# Altium project BCM.PrjPcb
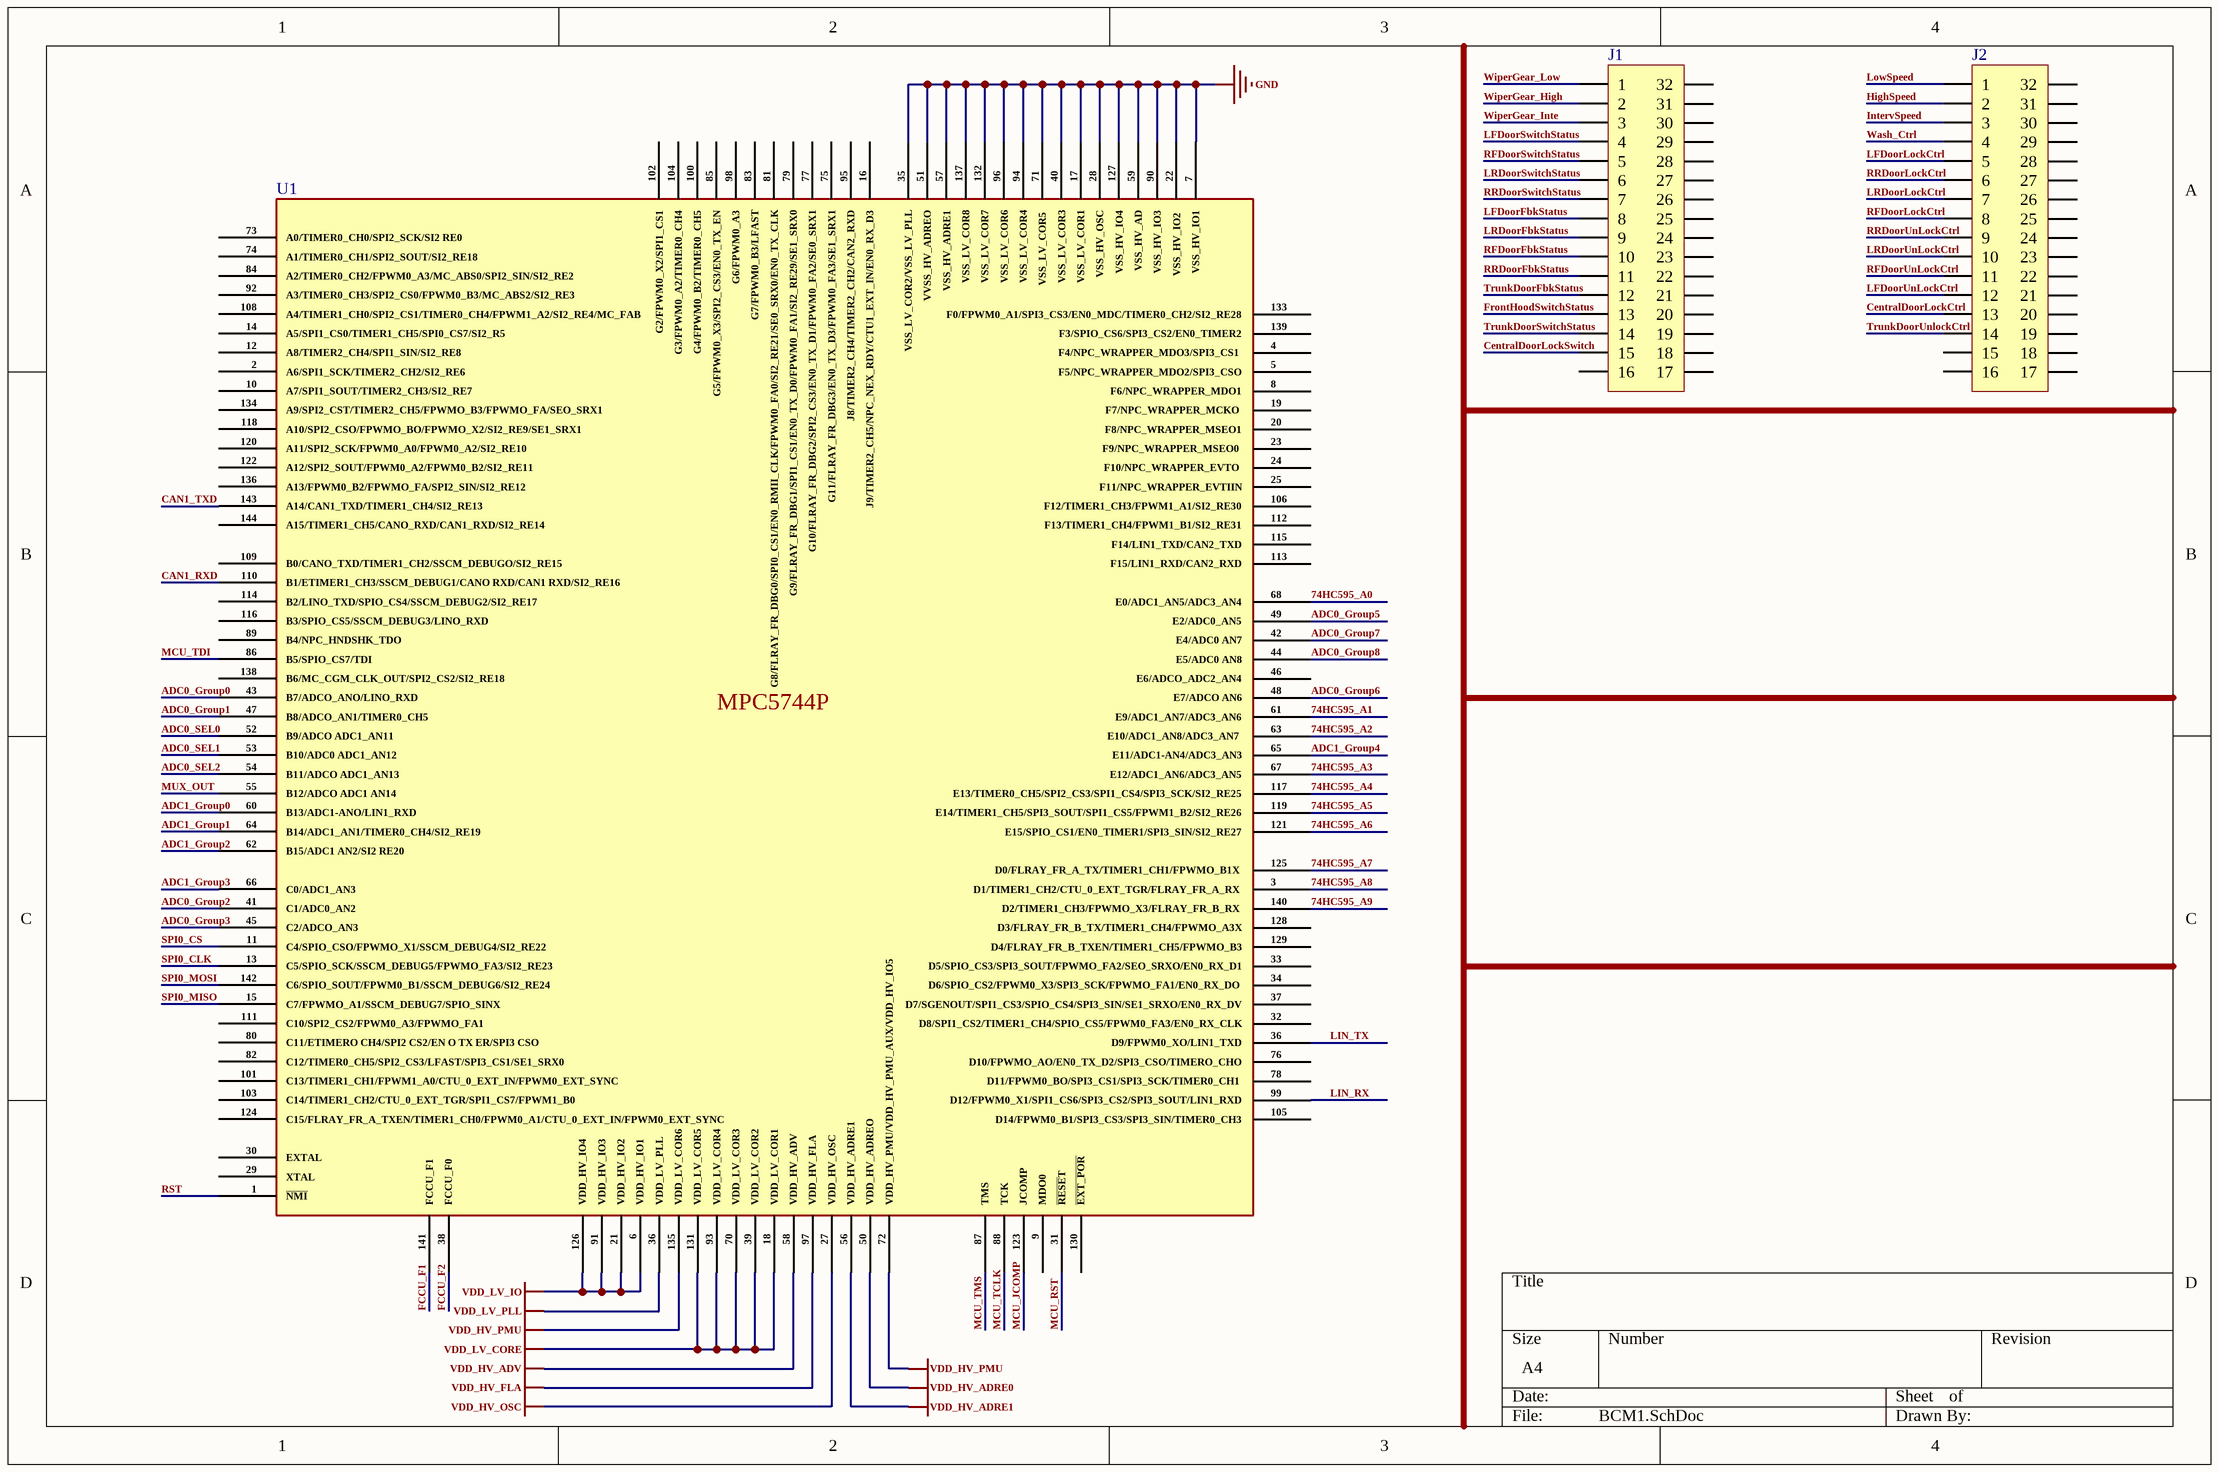
[diagram p0: BCM1.SchDoc]
4 sheets, 143 parts. Net scope: global (net labels, ports and power ports of the same name join across sheets).
Sheets:
  BCM1.SchDoc
  BCM2.SchDoc
  BCM3.SchDoc
  BCM4.SchDoc

## Sheet BCM1.SchDoc
size A4; SheetNumber: 1; SheetTotal: 5

### Parts
J1  DIP32  (value not drawn)
J2  DIP32  (value not drawn)
U1  MPC5744PFK1AMLQ9  (value not drawn)

### Nets
GND: U1.7(VSS_HV_IO1) U1.17(VSS_LV_COR1) U1.22(VSS_HV_IO2) U1.28(VSS_HV_OSC) U1.35(VSS_LV_COR2/VSS_LV_PLL) U1.40(VSS_LV_COR3) U1.51(VVSS_HV_ADREO) U1.57(VSS_HV_ADRE1) U1.59(VSS_HV_AD) U1.71(VSS_LV_COR5) U1.90(VSS_HV_IO3) U1.94(VSS_LV_COR4) U1.96(VSS_LV_COR6) U1.127(VSS_HV_IO4) U1.132(VSS_LV_COR7) U1.137(VSS_LV_COR8)  [project net DEBUG]
MCU_TDI: U1.86(B5/SPIO_CS7/TDI)
VDD_HV_ADRE0: U1.50(VDD_HV_ADREO)
VDD_HV_ADRE1: U1.56(VDD_HV_ADRE1)
VDD_HV_ADV: U1.58(VDD_HV_ADV)
VDD_HV_FLA: U1.97(VDD_HV_FLA)
VDD_HV_OSC: U1.27(VDD_HV_OSC)
VDD_HV_PMU: U1.72(VDD_HV_PMU/VDD_HV_PMU_AUX/VDD_HV_IO5) U1.135(VDD_LV_COR6)
VDD_LV_CORE: U1.18(VDD_LV_COR1) U1.39(VDD_LV_COR2) U1.70(VDD_LV_COR3) U1.93(VDD_LV_COR4) U1.131(VDD_LV_COR5)
VDD_LV_IO: U1.6(VDD_HV_IO1) U1.21(VDD_HV_IO2) U1.91(VDD_HV_IO3) U1.126(VDD_HV_IO4)
VDD_LV_PLL: U1.36(VDD_LV_PLL)
74HC595_A0: U1.68(E0/ADC1_AN5/ADC3_AN4)
74HC595_A1: U1.61(E9/ADC1_AN7/ADC3_AN6)
74HC595_A2: U1.63(E10/ADC1_AN8/ADC3_AN7)
74HC595_A3: U1.67(E12/ADC1_AN6/ADC3_AN5)
74HC595_A4: U1.117(E13/TIMER0_CH5/SPI2_CS3/SPI1_CS4/SPI3_SCK/SI2_RE25)
74HC595_A5: U1.119(E14/TIMER1_CH5/SPI3_SOUT/SPI1_CS5/FPWM1_B2/SI2_RE26)
74HC595_A6: U1.121(E15/SPIO_CS1/EN0_TIMER1/SPI3_SIN/SI2_RE27)
74HC595_A7: U1.125(D0/FLRAY_FR_A_TX/TIMER1_CH1/FPWMO_B1X)
74HC595_A8: U1.3(D1/TIMER1_CH2/CTU_0_EXT_TGR/FLRAY_FR_A_RX)
74HC595_A9: U1.140(D2/TIMER1_CH3/FPWMO_X3/FLRAY_FR_B_RX)
ADC0_Group0: U1.43(B7/ADCO_ANO/LINO_RXD)
ADC0_Group1: U1.47(B8/ADCO_AN1/TIMER0_CH5)
ADC0_Group2: U1.41(C1/ADC0_AN2)
ADC0_Group3: U1.45(C2/ADCO_AN3)
ADC0_Group5: U1.49(E2/ADC0_AN5)
ADC0_Group6: U1.48(E7/ADCO_AN6)
ADC0_Group7: U1.42(E4/ADC0_AN7)
ADC0_Group8: U1.44(E5/ADC0_AN8)
ADC0_SEL0: U1.52(B9/ADCO_ADC1_AN11)
ADC0_SEL1: U1.53(B10/ADC0_ADC1_AN12)
ADC0_SEL2: U1.54(B11/ADCO_ADC1_AN13)
ADC1_Group0: U1.60(B13/ADC1-ANO/LIN1_RXD)
ADC1_Group1: U1.64(B14/ADC1_AN1/TIMER0_CH4/SI2_RE19)
ADC1_Group2: U1.62(B15/ADC1_AN2/SI2_RE20)
ADC1_Group3: U1.66(C0/ADC1_AN3)
ADC1_Group4: U1.65(E11/ADC1-AN4/ADC3_AN3)
CAN1_RXD: U1.110(B1/ETIMER1_CH3/SSCM_DEBUG1/CANO_RXD/CAN1_RXD/SI2_RE16)
CAN1_TXD: U1.143(A14/CAN1_TXD/TIMER1_CH4/SI2_RE13)
CentralDoorLockCtrl: J2.13
CentralDoorLockSwitch: J1.15
FCCU_F1: U1.141(FCCU_F1)
FCCU_F2: U1.38(FCCU_F0)
FrontHoodSwitchStatus: J1.13
HighSpeed: J2.2
IntervSpeed: J2.3
LFDoorFbkStatus: J1.8
LFDoorLockCtrl: J2.5
LFDoorSwitchStatus: J1.4
LFDoorUnLockCtrl: J2.12
LIN_RX: U1.99(D12/FPWM0_X1/SPI1_CS6/SPI3_CS2/SPI3_SOUT/LIN1_RXD)
LIN_TX: U1.36(D9/FPWM0_XO/LIN1_TXD)
LowSpeed: J2.1
LRDoorFbkStatus: J1.9
LRDoorLockCtrl: J2.7
LRDoorSwitchStatus: J1.6
LRDoorUnLockCtrl: J2.10
MCU_JCOMP: U1.123(JCOMP)
MCU_RST: U1.31(~{RESE}T)  [project net DEBUG_RST]
MCU_TCLK: U1.88(TCK)
MCU_TMS: U1.87(TMS)
MUX_OUT: U1.55(B12/ADCO_ADC1_AN14)
RFDoorFbkStatus: J1.10
RFDoorLockCtrl: J2.8
RFDoorSwitchStatus: J1.5
RFDoorUnLockCtrl: J2.11
RRDoorFbkStatus: J1.11
RRDoorLockCtrl: J2.6
RRDoorSwitchStatus: J1.7
RRDoorUnLockCtrl: J2.9
RST: U1.1(~{NMI})
SPI0_CLK: U1.13(C5/SPIO_SCK/SSCM_DEBUG5/FPWMO_FA3/SI2_RE23)
SPI0_CS: U1.11(C4/SPIO_CSO/FPWMO_X1/SSCM_DEBUG4/SI2_RE22)
SPI0_MISO: U1.15(C7/FPWMO_A1/SSCM_DEBUG7/SPIO_SINX)
SPI0_MOSI: U1.142(C6/SPIO_SOUT/FPWM0_B1/SSCM_DEBUG6/SI2_RE24)
TrunkDoorFbkStatus: J1.12
TrunkDoorSwitchStatus: J1.14
TrunkDoorUnlockCtrl: J2.14
Wash_Ctrl: J2.4
WiperGear_High: J1.2
WiperGear_Inte: J1.3
WiperGear_Low: J1.1

Not connected (* = marked no-connect by the designer): J1 16 17 18 19 20 21 22 23 24 25 26 27 28 29 30 31 32; J2 15 16 17 18 19 20 21 22 23 24 25 26 27 28 29 30 31 32; U1 2(A6/SPI1_SCK/TIMER2_CH2/SI2_RE6) 4(F4/NPC_WRAPPER_MDO3/SPI3_CS1_) 5(F5/NPC_WRAPPER_MDO2/SPI3_CSO) 8(F6/NPC_WRAPPER_MDO1) 9(MDO0) 10(A7/SPI1_SOUT/TIMER2_CH3/SI2_RE7) 12(A8/TIMER2_CH4/SPI1_SIN/SI2_RE8) 14(A5/SPI1_CS0/TIMER1_CH5/SPI0_CS7/SI2_R5) 16(J9/TIMER2_CH5/NPC_NEX_RDY/CTU1_EXT_IN/EN0_RX_D3) 19(F7/NPC_WRAPPER_MCKO_) 20(F8/NPC_WRAPPER_MSEO1) 23(F9/NPC_WRAPPER_MSEO0_) 24(F10/NPC_WRAPPER_EVTO_) 25(F11/NPC_WRAPPER_EVTIIN) 29(XTAL) 30(EXTAL) 32(D8/SPI1_CS2/TIMER1_CH4/SPIO_CS5/FPWM0_FA3/EN0_RX_CLK) 33(D5/SPIO_CS3/SPI3_SOUT/FPWMO_FA2/SEO_SRXO/EN0_RX_D1) 34(D6/SPIO_CS2/FPWM0_X3/SPI3_SCK/FPWMO_FA1/EN0_RX_DO_) 37(D7/SGENOUT/SPI1_CS3/SPIO_CS4/SPI3_SIN/SE1_SRXO/EN0_RX_DV) 46(E6/ADCO_ADC2_AN4) 73(A0/TIMER0_CH0/SPI2_SCK/SI2_RE0) 74(A1/TIMER0_CH1/SPI2_SOUT/SI2_RE18) 75(G11/FLRAY_FR_DBG3/EN0_TX_D3/FPWM0_FA3/SE1_SRX1) 76(D10/FPWMO_AO/EN0_TX_D2/SPI3_CSO/TIMERO_CHO) 77(G10/FLRAY_FR_DBG2/SPI2_CS3/EN0_TX_D1/FPWM0_FA2/SE0_SRX1) 78(D11/FPWM0_BO/SPI3_CS1/SPI3_SCK/TIMER0_CH1_) 79(G9/FLRAY_FR_DBG1/SPI1_CS1/EN0_TX_D0/FPWM0_FA1/SI2_RE29/SE1_SRX0) 80(C11/ETIMERO_CH4/SPI2_CS2/EN_O_TX_ER/SPI3_CSO) 81(G8/FLRAY_FR_DBG0/SPI0_CS1/EN0_RMII_CLK/FPWM0_FA0/SI2_RE21/SE0_SRX0/EN0_TX_CLK) 82(C12/TIMER0_CH5/SPI2_CS3/LFAST/SPI3_CS1/SE1_SRX0) 83(G7/FPWM0_B3/LFAST) 84(A2/TIMER0_CH2/FPWM0_A3/MC_ABS0/SPI2_SIN/SI2_RE2) 85(G5/FPWM0_X3/SPI2_CS3/EN0_TX_EN) 89(B4/NPC_HNDSHK_TDO) 92(A3/TIMER0_CH3/SPI2_CS0/FPWM0_B3/MC_ABS2/SI2_RE3) 95(J8/TIMER2_CH4/TIMER2_CH2/CAN2_RXD) 98(G6/FPWM0_A3) 100(G4/FPWM0_B2/TIMER0_CH5) 101(C13/TIMER1_CH1/FPWM1_A0/CTU_0_EXT_IN/FPWM0_EXT_SYNC) 102(G2/FPWM0_X2/SPI1_CS1) 103(C14/TIMER1_CH2/CTU_0_EXT_TGR/SPI1_CS7/FPWM1_B0) 104(G3/FPWM0_A2/TIMER0_CH4) 105(D14/FPWM0_B1/SPI3_CS3/SPI3_SIN/TIMER0_CH3) 106(F12/TIMER1_CH3/FPWM1_A1/SI2_RE30) 108(A4/TIMER1_CH0/SPI2_CS1/TIMER0_CH4/FPWM1_A2/SI2_RE4/MC_FAB_) 109(B0/CANO_TXD/TIMER1_CH2/SSCM_DEBUGO/SI2_RE15) 111(C10/SPI2_CS2/FPWM0_A3/FPWMO_FA1) 112(F13/TIMER1_CH4/FPWM1_B1/SI2_RE31) 113(F15/LIN1_RXD/CAN2_RXD) 114(B2/LINO_TXD/SPIO_CS4/SSCM_DEBUG2/SI2_RE17) 115(F14/LIN1_TXD/CAN2_TXD) 116(B3/SPIO_CS5/SSCM_DEBUG3/LINO_RXD) 118(A10/SPI2_CSO/FPWMO_BO/FPWMO_X2/SI2_RE9/SE1_SRX1) 120(A11/SPI2_SCK/FPWM0_A0/FPWM0_A2/SI2_RE10) 122(A12/SPI2_SOUT/FPWM0_A2/FPWM0_B2/SI2_RE11) 124(C15/FLRAY_FR_A_TXEN/TIMER1_CH0/FPWM0_A1/CTU_0_EXT_IN/FPWM0_EXT_SYNC) 128(D3/FLRAY_FR_B_TX/TIMER1_CH4/FPWMO_A3X) 129(D4/FLRAY_FR_B_TXEN/TIMER1_CH5/FPWMO_B3) 130(~{EXT_POR}) 133(F0/FPWM0_A1/SPI3_CS3/EN0_MDC/TIMER0_CH2/SI2_RE28) 134(A9/SPI2_CST/TIMER2_CH5/FPWMO_B3/FPWMO_FA/SEO_SRX1_) 136(A13/FPWM0_B2/FPWMO_FA/SPI2_SIN/SI2_RE12) 138(B6/MC_CGM_CLK_OUT/SPI2_CS2/SI2_RE18) 139(F3/SPIO_CS6/SPI3_CS2/EN0_TIMER2) 144(A15/TIMER1_CH5/CANO_RXD/CAN1_RXD/SI2_RE14)

### Notes on the sheet
- (in symbol MPC5744PFK1AMLQ9) MPC5744P

## Sheet BCM2.SchDoc
size A4; SheetNumber: 2; SheetTotal: 4
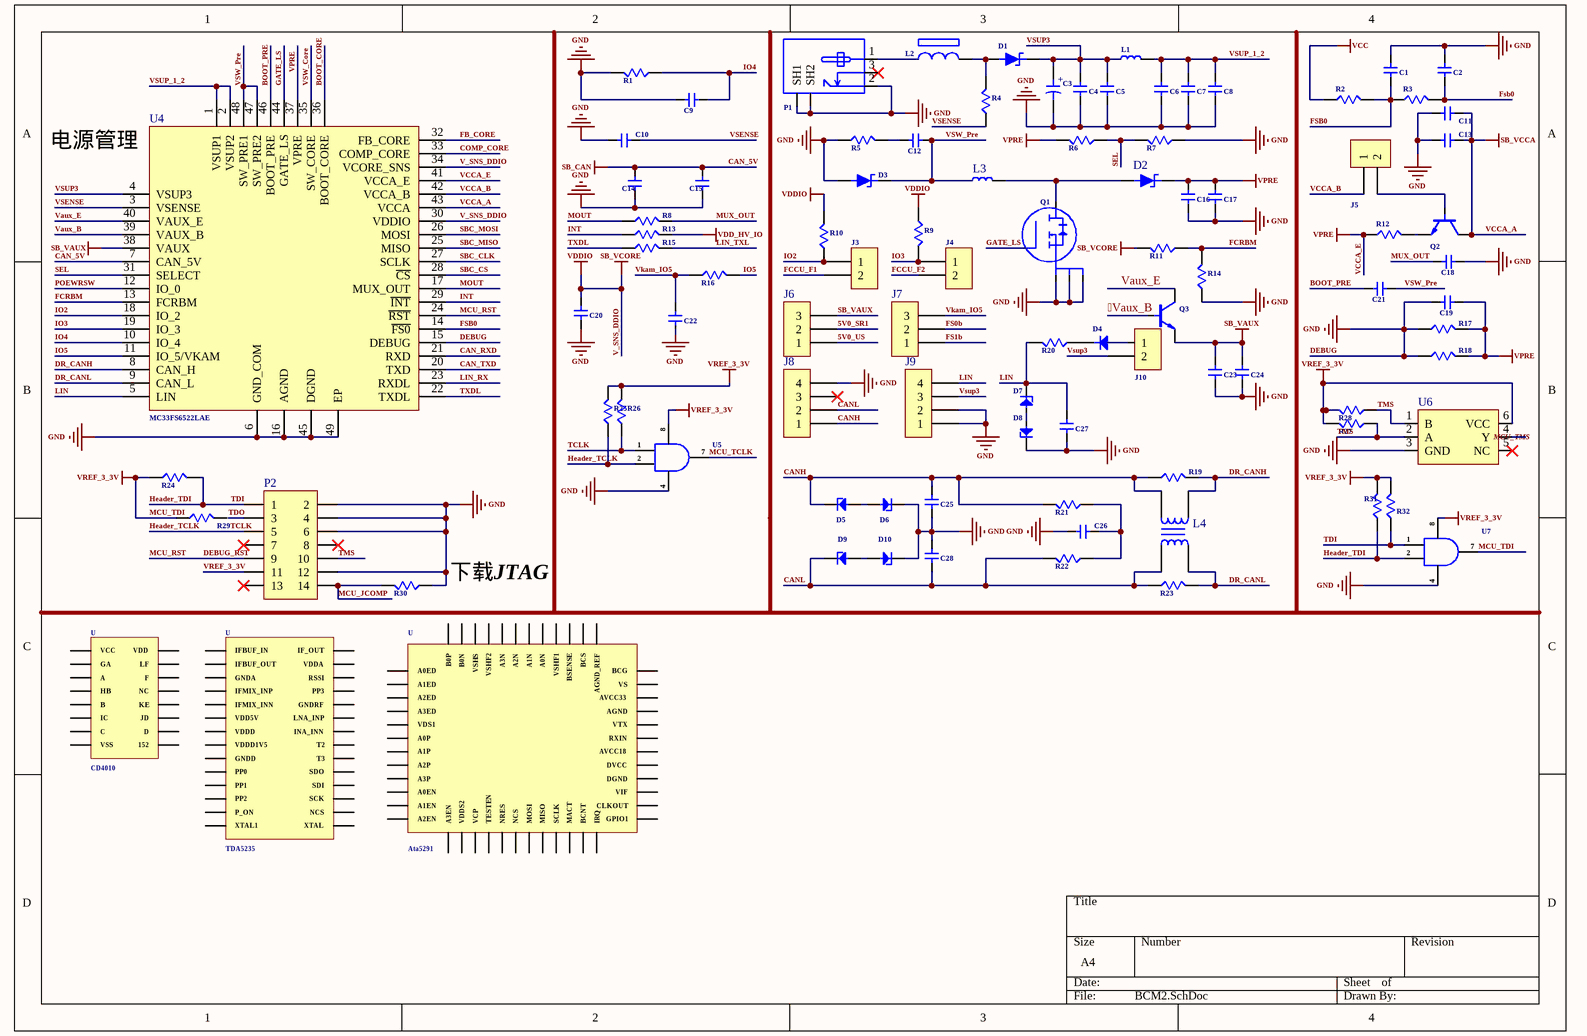
[diagram p1: BCM2.SchDoc]

### Parts
C1  CAP  (value not drawn)
C2  CAP  (value not drawn)
C3  CAP_Election  (value not drawn)
C4  CAP  (value not drawn)
C5  CAP  (value not drawn)
C6  CAP  (value not drawn)
C7  CAP  (value not drawn)
C8  CAP  (value not drawn)
C9  CAP  (value not drawn)
C10  CAP  (value not drawn)
C11  CAP  (value not drawn)
C12  CAP  (value not drawn)
C13  CAP  (value not drawn)
C14  CAP  (value not drawn)
C15  CAP  (value not drawn)
C16  CAP  (value not drawn)
C17  CAP  (value not drawn)
C18  CAP  (value not drawn)
C19  CAP  (value not drawn)
C20  CAP  (value not drawn)
C21  CAP  (value not drawn)
C22  CAP  (value not drawn)
C23  CAP  (value not drawn)
C24  CAP  (value not drawn)
C25  CAP  (value not drawn)
C26  CAP  (value not drawn)
C27  CAP  (value not drawn)
C28  CAP  (value not drawn)
D1  ZENER  (value not drawn)
D2  ZENER  (value not drawn)
D3  ZENER  (value not drawn)
D4  DIODE  (value not drawn)
D5  ZENER1  (value not drawn)
D6  ZENER1  (value not drawn)
D7  ZENER1  (value not drawn)
D8  ZENER1  (value not drawn)
D9  ZENER1  (value not drawn)
D10  ZENER1  (value not drawn)
J3  CON2  (value not drawn)
J4  CON2  (value not drawn)
J5  CON2  [DG1282-5.0]  (value not drawn)
J6  CON3  (value not drawn)
J7  CON3  (value not drawn)
J8  CON4  (value not drawn)
J9  CON4  (value not drawn)
J10  CON2  (value not drawn)
L1  L  (value not drawn)
L2  BLM18KG121TZ1  (value not drawn)
L3  L  (value not drawn)
L4  TRANS1  (value not drawn)
P1  CON_PWR  (value not drawn)
P2  DIP14  (value not drawn)
Q1  BUK9M24  (value not drawn)
Q2  NPN  [TO-92]  (value not drawn)
Q3  NPN  [TO-92]  (value not drawn)
R1  RES  (value not drawn)
R2  RES  (value not drawn)
R3  RES  (value not drawn)
R4  RES  (value not drawn)
R5  RES  (value not drawn)
R6  RES  (value not drawn)
R7  RES  (value not drawn)
R8  RES  (value not drawn)
R9  RES  (value not drawn)
R10  RES  (value not drawn)
R11  RES  (value not drawn)
R12  RES  (value not drawn)
R13  RES  (value not drawn)
R14  RES  (value not drawn)
R15  RES  (value not drawn)
R16  RES  (value not drawn)
R17  RES  (value not drawn)
R18  RES  (value not drawn)
R19  RES  (value not drawn)
R20  RES  (value not drawn)
R21  RES  (value not drawn)
R22  RES  (value not drawn)
R23  RES  (value not drawn)
R24  RES  (value not drawn)
R25  RES  (value not drawn)
R26  RES  (value not drawn)
R27  RES  (value not drawn)
R28  RES  (value not drawn)
R29  RES  (value not drawn)
R30  RES  (value not drawn)
R31  RES  (value not drawn)
R32  RES  (value not drawn)
U4  MC33FS6522LAE
U5  74LVC2G08  (value not drawn)
U6  74LVC1G08  (value not drawn)
U7  74LVC2G08  (value not drawn)

### Nets
CAN_5V: C14.1 C15.1 U4.7(CAN_5V)  [also labelled SB_CAN]
DEBUG: C1.1 C2.1 C3.2 C4.2 C5.2 C6.2 C7.2 C8.2 C9.1 C10.1 C11.2 C13.2 C14.2 C15.2 C16.2 C17.2 C18.1 C19.1 C20.2 C22.2 C23.2 C24.2 C25.1 C26.1 C27.1 C28.2 D3.1(A) D6.2(K) D8.2(K) D10.2(K) J8.4 J9.1 J9.2 P1.2 P1.5(SH1) P1.?1(SH2) P2.2 P2.4 P2.6 P2.12 Q1.1 Q1.2 Q1.3 R1.2 R5.1 R7.1 R14.1 R17.1 R18.1 R30.1 U4.6(GND_COM) U4.15(DEBUG) U4.16(AGND) U4.45(DGND) U4.49(EP) U5.4 U6.3(GND) U7.4  [also labelled GND]
MCU_TDI: P2.11 R24.1 R25.2 R26.2 R27.2 R28.2 R29.1 R31.2 R32.2 U5.8 U6.6(VCC) U7.7(Y) U7.8  [also labelled VREF_3_3V]
SB_VAUX: C23.1 C24.1 J6.3 Q3.E(e) U4.38(VAUX)
V_SNS_DDIO: C20.1 R9.1 R10.2 R11.2 U4.30(VDDIO) U4.34(VCORE_SNS)  [also labelled SB_VCORE, VDDIO]
VCC: R2.1
VCCA_A: C11.1 C13.1 Q2.C(c) U4.43(VCCA)  [also labelled SB_VCCA]
VCCA_E: C16.1 C17.1 C19.2 D2.2(K) R6.2 R12.1 R17.2 R18.2 U4.37(VPRE) U4.41(VCCA_E)  [also labelled VPRE]
VDD_HV_IO: R13.2
5V0_SR1: J6.2
5V0_US: J6.1
Vaux_B: Q3.B(b)
BOOT_CORE: U4.36(BOOT_CORE)
BOOT_PRE: C21.1 U4.46(BOOT_PRE)
CAN_RXD: U4.21(RXD)
CAN_TXD: U4.20(TXD)
CANH: C25.2 D5.2(K) J8.1 L4.3 R19.1 R21.2
CANL: C28.1 D9.2(K) J8.2 L4.1 R22.2 R23.1
COMP_CORE: U4.33(COMP_CORE)
DEBUG_RST: P2.9 U4.24(~{RST})  [also labelled MCU_RST]
DR_CANH: L4.1 R19.2 U4.8(CAN_H)
DR_CANL: L4.3 R23.2 U4.9(CAN_L)
FB_CORE: U4.32(FB_CORE)
FCCU_F1: J3.2
FCCU_F2: J4.2
FCRBM: R11.1 R14.2 U4.13(FCRBM)
FS0b: J7.2
FS1b: J7.1
Fsb0: C1.2 C2.2 R2.2 R3.1 R3.2 U4.14(~{FS0})
GATE_LS: Q1.5 U4.44(GATE_LS)
Header_TCLK: P2.5 R25.1 R26.1 U5.1(A) U5.2(B)  [also labelled TCLK]
Header_TDI: P2.1 R24.2 R31.1 R32.1 U7.1(A) U7.2(B)  [also labelled TDI]
INT: R13.1 U4.29(~{INT})
IO2: J3.1 R10.1 U4.18(IO_2)
IO3: J4.1 R9.2 U4.19(IO_3)
IO4: C9.2 R1.1 U4.10(IO_4)
IO5: R16.2 U4.11(IO_5/VKAM)
LIN: C27.2 D7.2(K) J9.4 R20.2 U4.5(LIN)
LIN_RX: U4.23(RXDL)
LIN_TXL: R15.2
MCU_JCOMP: P2.14 R30.2
MCU_TCLK: U5.7(Y)
MCU_TMS: U6.4(Y)
MOUT: R8.1 U4.17(MUX_OUT)
MUX_OUT: C18.2 R8.2
POEWRSW: U4.12(IO_0)
SBC_CLK: U4.27(SCLK)
SBC_CS: U4.28(~{CS})
SBC_MISO: U4.25(MISO)
SBC_MOSI: U4.26(MOSI)
SEL: R6.1 R7.2 U4.31(SELECT)
TDO: P2.3
TMS: P2.10 R27.1 R28.1 U6.1(B) U6.2(A)
TXDL: R15.1 U4.22(TXDL)
Vaux_B: U4.39(VAUX_B)
Vaux_E: Q3.C(c) U4.40(VAUX_E)
VCCA_B: J5.1 U4.42(VCCA_B)
Vkam_IO5: C22.1 J7.3 R16.1
VSENSE: C10.2 R4.1 U4.3(VSENSE)
VSUP3: C3.1 C4.1 C5.1 D1.2(K) J9.3 J10.2 L1.2 U4.4(VSUP3)
VSUP_1_2: C6.1 C7.1 C8.1 L1.1 U4.1(VSUP1) U4.2(VSUP2)
VSW_Core: U4.35(SW_CORE)
VSW_Pre: C12.1 C21.2 D3.2(K) L3.2 U4.47(SW_PRE2) U4.48(SW_PRE1)
NetC12_2: C12.2 R5.2
NetC26_2: C26.2 R21.1 R22.1
NetD1_1: D1.1(A) L2.1 R4.2
NetD2_1: D2.1(A) L3.1 Q1.5
NetD4_1: D4.1(A) J10.1
NetD4_2: D4.2(K) R20.1
NetD5_1: D5.1(A) D6.1(A)
NetD7_1: D7.1(A) D8.1(A)
NetD9_1: D9.1(A) D10.1(A)
NetJ5_2: J5.2 Q2.B(b)
NetL2_2: L2.2 P1.1
NetQ2_E: Q2.E(e) R12.2

Not connected (* = marked no-connect by the designer): J8 3*; P1 3*; P2 7* 8* 13*; R29 2; U6 5(NC)*

### Notes on the sheet
- (near U4) 电源管理
- (near R30) 下载JTAG
- (in symbol CAP_Election) +

### Library data of the parts
J3 J4 J10 = CON2: Connector
J6 J7 = CON3: Connector
J8 J9 = CON4: Connector

## Sheet BCM3.SchDoc
size A4; SheetNumber: 3; SheetTotal: 5
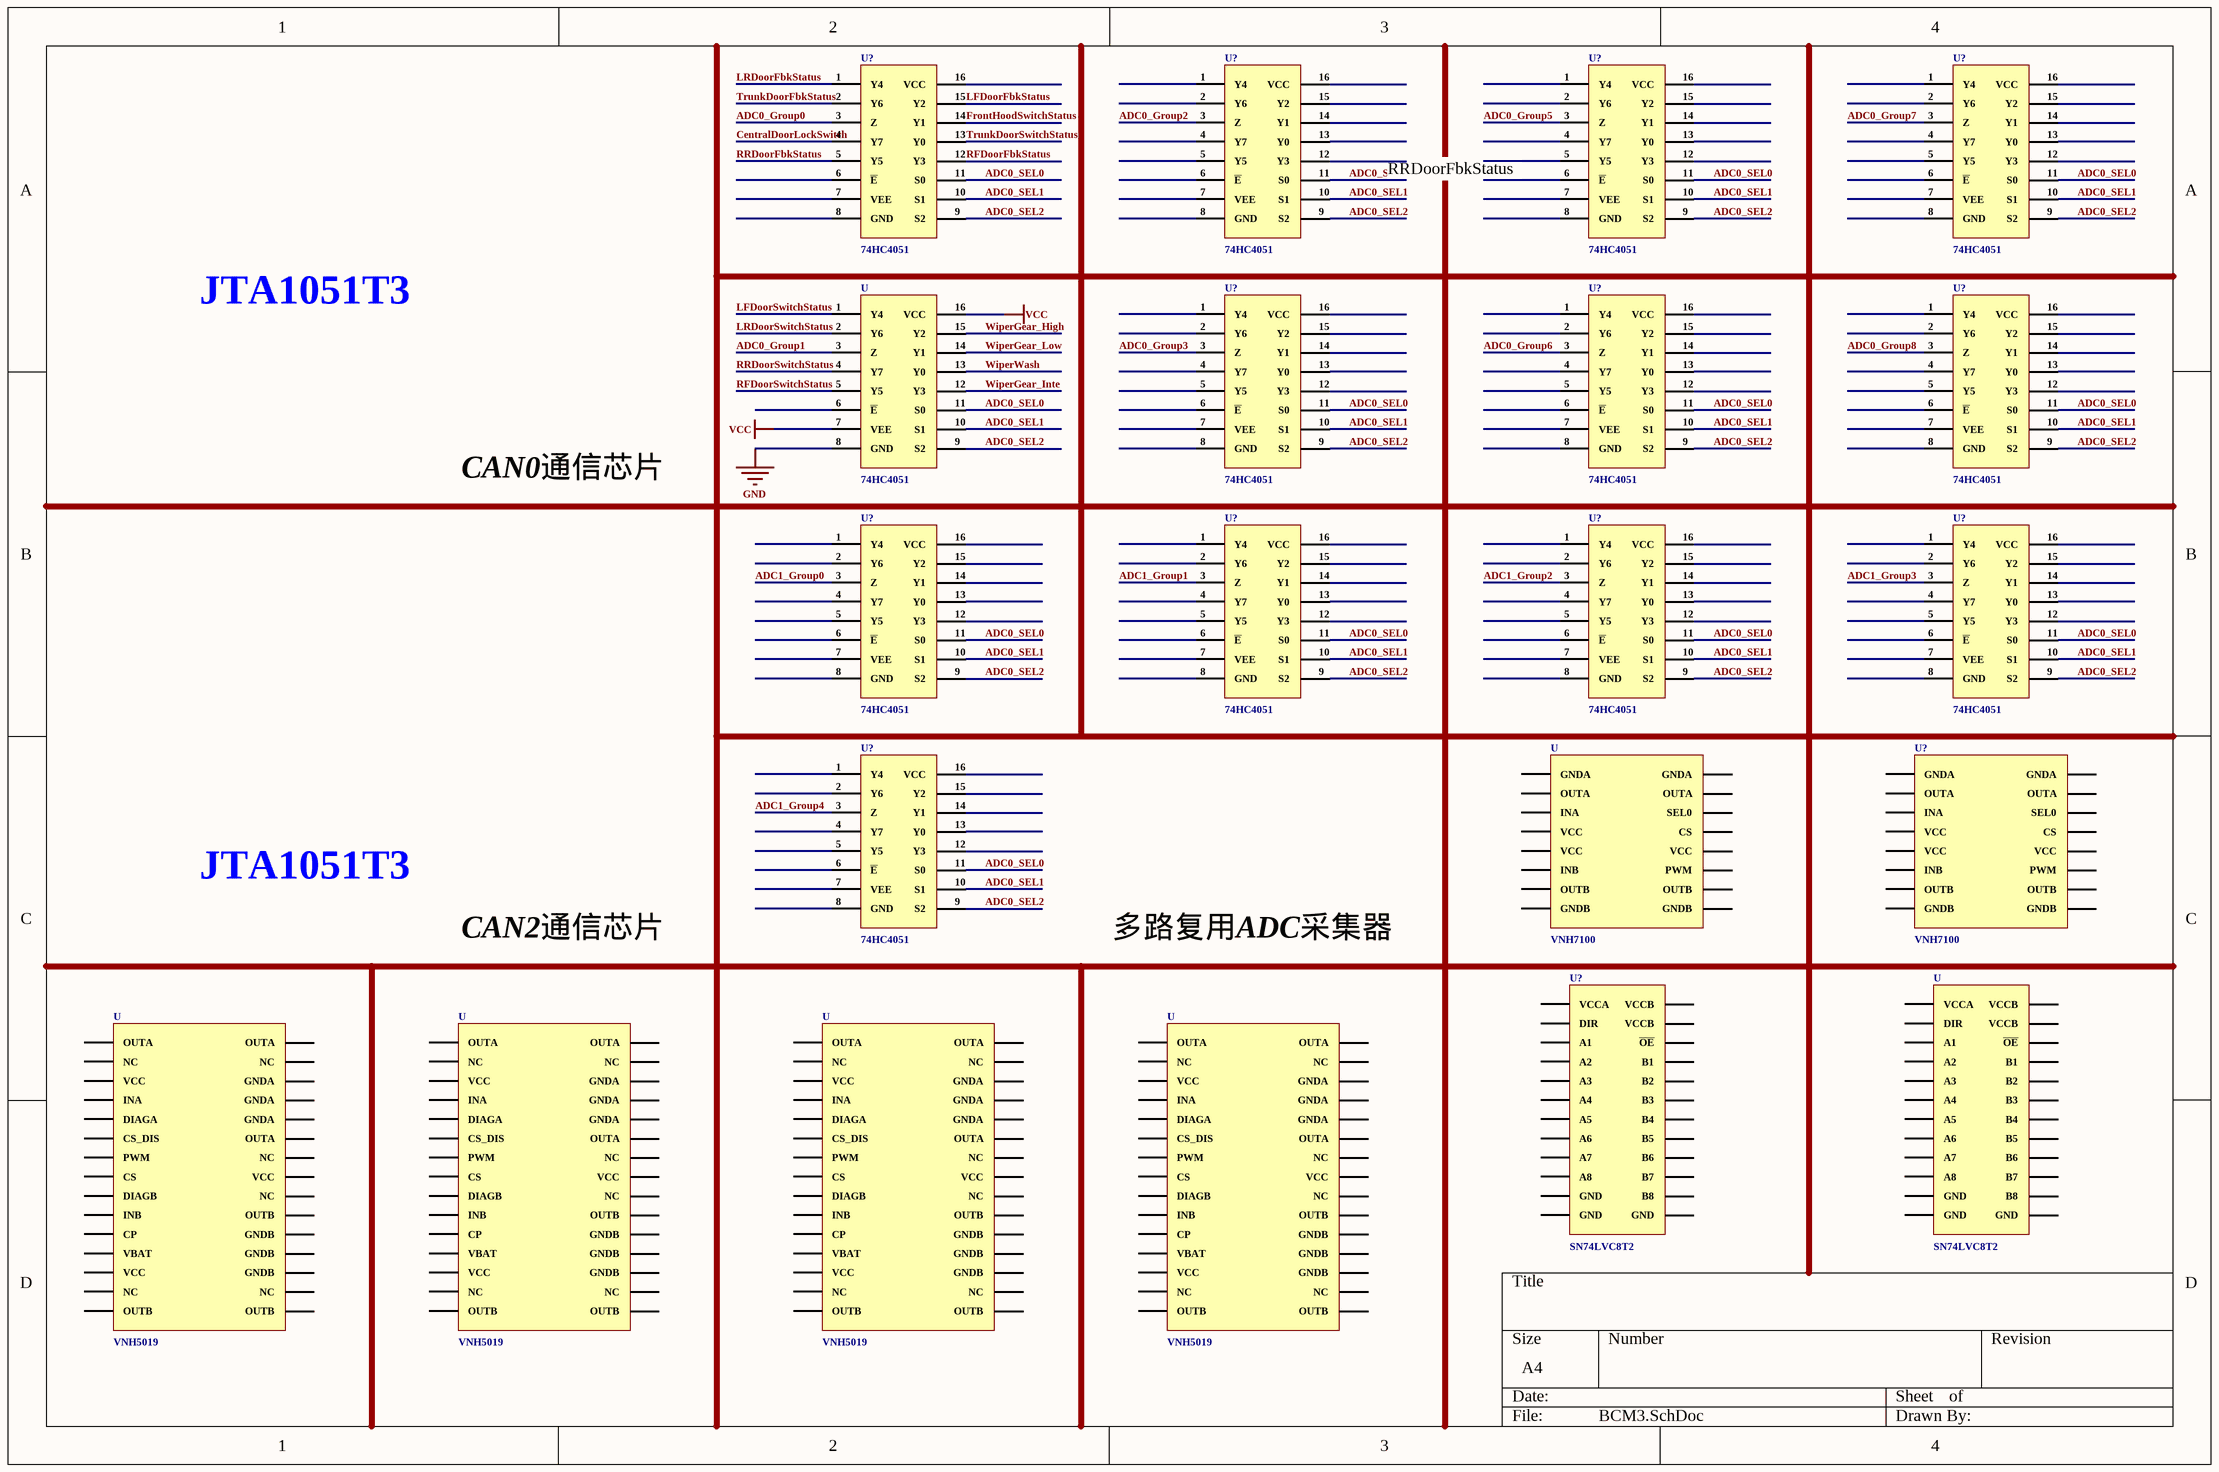
[diagram p2: BCM3.SchDoc]

### Parts
(Parts that share a designator on the sheet are numbered #1, #2 ... from top to bottom, then left to right.)
U#1  74HC4051
U#2  VNH7100
U#3  SN74LVC8T2
U#4  VNH5019
U#5  VNH5019
U#6  VNH5019
U#7  VNH5019
U?#1  74HC4051
U?#2  74HC4051
U?#3  74HC4051
U?#4  74HC4051
U?#5  74HC4051
U?#6  74HC4051
U?#7  74HC4051
U?#8  74HC4051
U?#9  74HC4051
U?#10  74HC4051
U?#11  74HC4051
U?#12  74HC4051
U?#13  VNH7100
U?#14  SN74LVC8T2

### Nets
GND: U#1.8(GND)  [project net DEBUG]
VCC: U#1.7(VEE) U#1.16(VCC)
ADC0_Group0: U?#1.3(Z)
ADC0_Group1: U#1.3(Z)
ADC0_Group2: U?#2.3(Z)
ADC0_Group3: U?#5.3(Z)
ADC0_Group5: U?#3.3(Z)
ADC0_Group6: U?#6.3(Z)
ADC0_Group7: U?#4.3(Z)
ADC0_Group8: U?#7.3(Z)
ADC0_SEL0: U#1.11(S0) U?#1.11(S0) U?#2.11(S0) U?#3.11(S0) U?#4.11(S0) U?#5.11(S0) U?#6.11(S0) U?#7.11(S0) U?#8.11(S0) U?#9.11(S0) U?#10.11(S0) U?#11.11(S0) U?#12.11(S0)
ADC0_SEL1: U#1.10(S1) U?#1.10(S1) U?#2.10(S1) U?#3.10(S1) U?#4.10(S1) U?#5.10(S1) U?#6.10(S1) U?#7.10(S1) U?#8.10(S1) U?#9.10(S1) U?#10.10(S1) U?#11.10(S1) U?#12.10(S1)
ADC0_SEL2: U#1.9(S2) U?#1.9(S2) U?#2.9(S2) U?#3.9(S2) U?#4.9(S2) U?#5.9(S2) U?#6.9(S2) U?#7.9(S2) U?#8.9(S2) U?#9.9(S2) U?#10.9(S2) U?#11.9(S2) U?#12.9(S2)
ADC1_Group0: U?#8.3(Z)
ADC1_Group1: U?#9.3(Z)
ADC1_Group2: U?#10.3(Z)
ADC1_Group3: U?#11.3(Z)
ADC1_Group4: U?#12.3(Z)
CentralDoorLockSwitch: U?#1.4(Y7)
FrontHoodSwitchStatus: U?#1.14(Y1)
LFDoorFbkStatus: U?#1.15(Y2)
LFDoorSwitchStatus: U#1.1(Y4)
LRDoorFbkStatus: U?#1.1(Y4)
LRDoorSwitchStatus: U#1.2(Y6)
RFDoorFbkStatus: U?#1.12(Y3)
RFDoorSwitchStatus: U#1.5(Y5)
RRDoorFbkStatus: U?#1.5(Y5)
RRDoorSwitchStatus: U#1.4(Y7)
TrunkDoorFbkStatus: U?#1.2(Y6)
TrunkDoorSwitchStatus: U?#1.13(Y0)
WiperGear_High: U#1.15(Y2)
WiperGear_Inte: U#1.12(Y3)
WiperGear_Low: U#1.14(Y1)
WiperWash: U#1.13(Y0)

Not connected (* = marked no-connect by the designer): U#1 6(~{E}); U#2 30(GNDA) 31(OUTA) 32(INA) 33(VCC) 34(VCC) 35(INB) 36(OUTB) 37(GNDB) 38(CS) 39(VCC) 40(PWM) 41(OUTB) 42(GNDB); U#3 2(DIR) ?1(A1) VCCA; U#4 43(OUTA) 44(NC) 45(VCC) 46(INA) 47(DIAGA) 48(CS_DIS) 49(PWM) 50(CS) 51(DIAGB) 52(INB) 53(CP) 54(VBAT) 55(VCC) 56(NC) 57(OUTB); U#5 43(OUTA) 44(NC) 45(VCC) 46(INA) 47(DIAGA) 48(CS_DIS) 49(PWM) 50(CS) 51(DIAGB) 52(INB) 53(CP) 54(VBAT) 55(VCC) 56(NC) 57(OUTB); U#6 43(OUTA) 44(NC) 45(VCC) 46(INA) 47(DIAGA) 48(CS_DIS) 49(PWM) 50(CS) 51(DIAGB) 52(INB) 53(CP) 54(VBAT) 55(VCC) 56(NC) 57(OUTB); U#7 43(OUTA) 44(NC) 45(VCC) 46(INA) 47(DIAGA) 48(CS_DIS) 49(PWM) 50(CS) 51(DIAGB) 52(INB) 53(CP) 54(VBAT) 55(VCC) 56(NC) 57(OUTB); U?#1 6(~{E}) 7(VEE) 8(GND) 16(VCC); U?#2 1(Y4) 2(Y6) 4(Y7) 5(Y5) 6(~{E}) 7(VEE) 8(GND) 12(Y3) 13(Y0) 14(Y1) 15(Y2) 16(VCC); U?#3 1(Y4) 2(Y6) 4(Y7) 5(Y5) 6(~{E}) 7(VEE) 8(GND) 12(Y3) 13(Y0) 14(Y1) 15(Y2) 16(VCC); U?#4 1(Y4) 2(Y6) 4(Y7) 5(Y5) 6(~{E}) 7(VEE) 8(GND) 12(Y3) 13(Y0) 14(Y1) 15(Y2) 16(VCC); U?#5 1(Y4) 2(Y6) 4(Y7) 5(Y5) 6(~{E}) 7(VEE) 8(GND) 12(Y3) 13(Y0) 14(Y1) 15(Y2) 16(VCC); U?#6 1(Y4) 2(Y6) 4(Y7) 5(Y5) 6(~{E}) 7(VEE) 8(GND) 12(Y3) 13(Y0) 14(Y1) 15(Y2) 16(VCC); U?#7 1(Y4) 2(Y6) 4(Y7) 5(Y5) 6(~{E}) 7(VEE) 8(GND) 12(Y3) 13(Y0) 14(Y1) 15(Y2) 16(VCC); U?#8 1(Y4) 2(Y6) 4(Y7) 5(Y5) 6(~{E}) 7(VEE) 8(GND) 12(Y3) 13(Y0) 14(Y1) 15(Y2) 16(VCC); U?#9 1(Y4) 2(Y6) 4(Y7) 5(Y5) 6(~{E}) 7(VEE) 8(GND) 12(Y3) 13(Y0) 14(Y1) 15(Y2) 16(VCC); U?#10 1(Y4) 2(Y6) 4(Y7) 5(Y5) 6(~{E}) 7(VEE) 8(GND) 12(Y3) 13(Y0) 14(Y1) 15(Y2) 16(VCC); U?#11 1(Y4) 2(Y6) 4(Y7) 5(Y5) 6(~{E}) 7(VEE) 8(GND) 12(Y3) 13(Y0) 14(Y1) 15(Y2) 16(VCC); U?#12 1(Y4) 2(Y6) 4(Y7) 5(Y5) 6(~{E}) 7(VEE) 8(GND) 12(Y3) 13(Y0) 14(Y1) 15(Y2) 16(VCC); U?#13 30(GNDA) 31(OUTA) 32(INA) 33(VCC) 34(VCC) 35(INB) 36(OUTB) 37(GNDB) 38(CS) 39(VCC) 40(PWM) 41(OUTB) 42(GNDB); U?#14 2(DIR) ?1(A1) VCCA

### Notes on the sheet
- (near U?#3) RRDoorFbkStatus
- JTA1051T3
- CAN0通信芯片
- CAN2通信芯片
- 多路复用ADC采集器

## Sheet BCM4.SchDoc
size A4; SheetNumber: 4; SheetTotal: 5
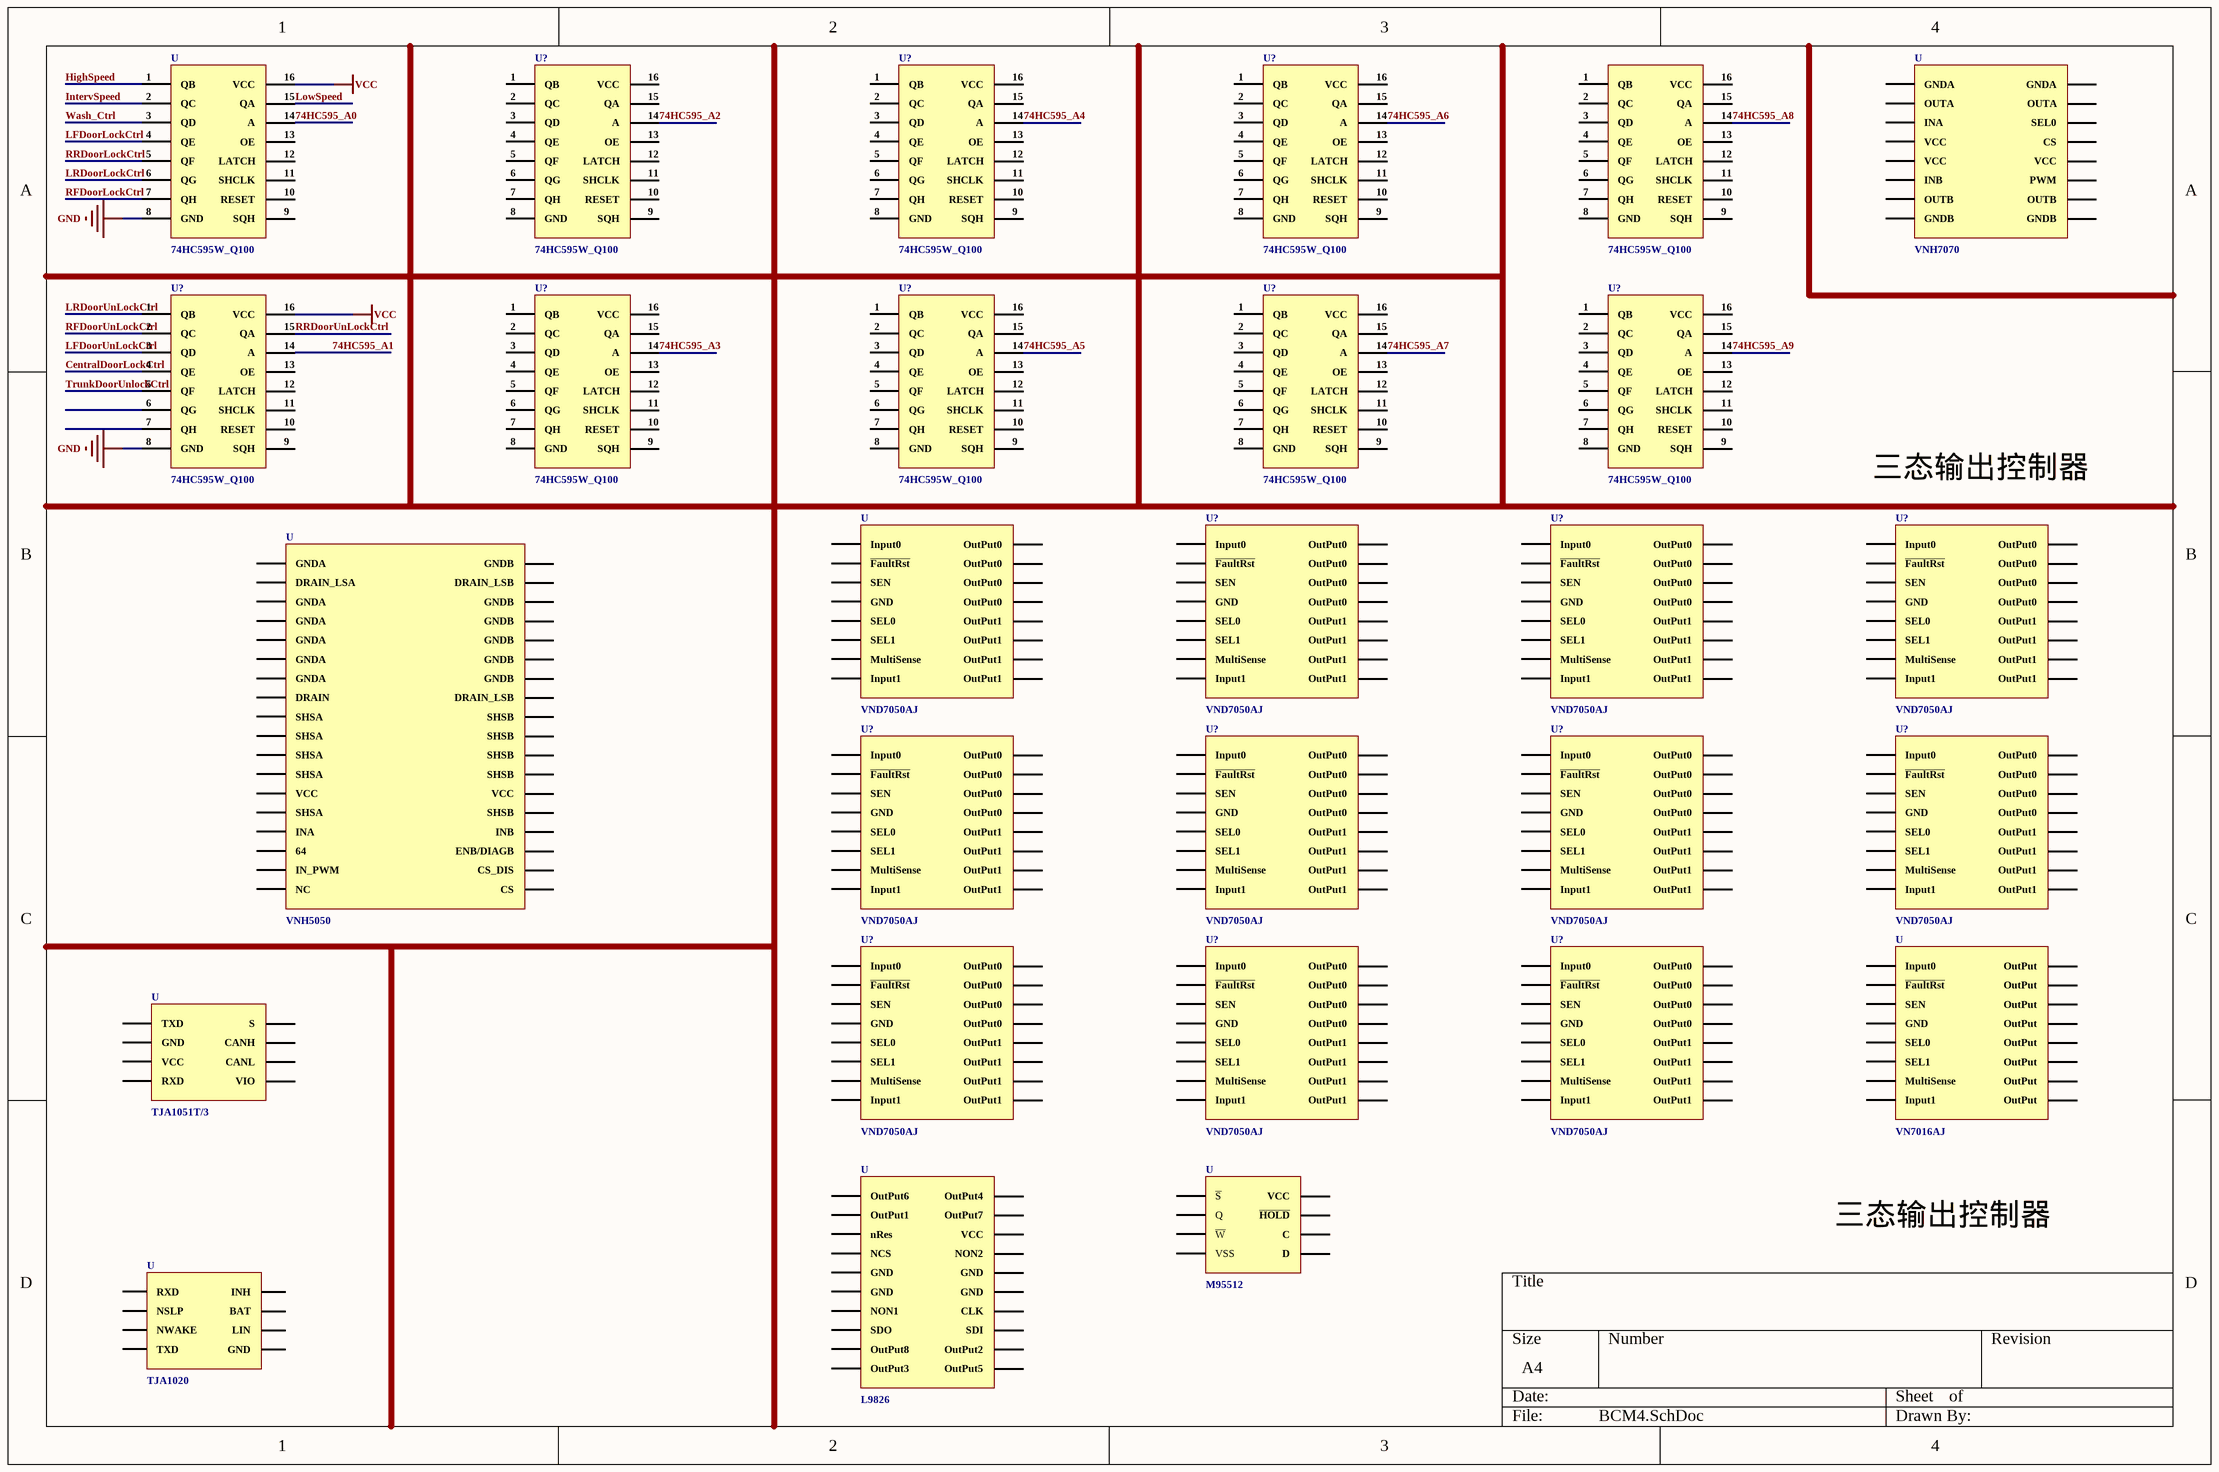
[diagram p3: BCM4.SchDoc]

### Parts
(Parts that share a designator on the sheet are numbered #1, #2 ... from top to bottom, then left to right.)
?  74HC595W_Q100
U#8  74HC595W_Q100
U#9  VNH7070
U#10  VND7050AJ
U#11  VNH5050
U#12  TJA1051T/3
U#13  VN7016AJ
U#14  M95512
U#15  TJA1020
U#16  L9826
U?#15  74HC595W_Q100
U?#16  74HC595W_Q100
U?#17  74HC595W_Q100
U?#18  74HC595W_Q100
U?#19  74HC595W_Q100
U?#20  74HC595W_Q100
U?#21  74HC595W_Q100
U?#22  74HC595W_Q100
U?#23  VND7050AJ
U?#24  VND7050AJ
U?#25  VND7050AJ
U?#26  VND7050AJ
U?#27  VND7050AJ
U?#28  VND7050AJ
U?#29  VND7050AJ
U?#30  VND7050AJ
U?#31  VND7050AJ
U?#32  VND7050AJ

### Nets
GND: U#8.8(GND) U?#18.8(GND)  [project net DEBUG]
VCC: U#8.16(VCC) U?#18.16(VCC)
74HC595_A0: U#8.14(A)
74HC595_A1: U?#18.14(A)
74HC595_A2: U?#15.14(A)
74HC595_A3: U?#19.14(A)
74HC595_A4: U?#16.14(A)
74HC595_A5: U?#20.14(A)
74HC595_A6: U?#17.14(A)
74HC595_A7: U?#21.14(A)
74HC595_A8: ?.14(A)
74HC595_A9: U?#22.14(A)
CentralDoorLockCtrl: U?#18.4(QE)
HighSpeed: U#8.1(QB)
IntervSpeed: U#8.2(QC)
LFDoorLockCtrl: U#8.4(QE)
LFDoorUnLockCtrl: U?#18.3(QD)
LowSpeed: U#8.15(QA)
LRDoorLockCtrl: U#8.6(QG)
LRDoorUnLockCtrl: U?#18.1(QB)
RFDoorLockCtrl: U#8.7(QH)
RFDoorUnLockCtrl: U?#18.2(QC)
RRDoorLockCtrl: U#8.5(QF)
RRDoorUnLockCtrl: U?#18.15(QA)
TrunkDoorUnlockCtrl: U?#18.5(QF)
Wash_Ctrl: U#8.3(QD)

Not connected (* = marked no-connect by the designer): ? 1(QB) 2(QC) 3(QD) 4(QE) 5(QF) 6(QG) 7(QH) 8(GND) 9(SQH) 10(RESET) 11(SHCLK) 12(LATCH) 13(OE) 15(QA) 16(VCC); U#8 9(SQH) 10(RESET) 11(SHCLK) 12(LATCH) 13(OE); U#9 67(GNDA) 68(INA) 69(OUTA) 70(VCC) 71(VCC) 72(INB) 73(OUTB) 74(GNDB) 75(GNDA) 76(OUTA) 77(SEL0) 78(CS) 79(VCC) 80(PWM) 81(OUTB) 82(GNDB); U#10 83(Input0) 84(~{FaultRst}) 85(SEN) 86(GND) 87(SEL0) 88(SEL1) 89(MultiSense) 90(Input1) 91(OutPut0) 92(OutPut0) 93(OutPut0) 94(OutPut0) 95(OutPut1) 96(OutPut1) 97(OutPut1) 98(OutPut1); U#11 58(GNDA) 59(DRAIN_LSA) 60(GNDA) 61(GNDA) 62(GNDA) 63(GNDA) 64(GNDA) 65(DRAIN) 66(SHSA); U#12 129(TXD) 130(GND) 131(VCC) 132(RXD) 133(S) 134(CANH) 135(CANL) 136(VIO); U#13 83(Input0) 84(~{FaultRst}) 85(SEN) 86(GND) 87(SEL0) 88(SEL1) 89(MultiSense) 90(Input1) 99(OutPut) 100(OutPut) 101(OutPut) 102(OutPut) 103(OutPut) 104(OutPut) 105(OutPut) 106(OutPut); U#14 117(~{S}) 118(Q) 119(~{W}) 120(VSS) 121(VCC) 122(~{HOLD}) 123(C) 124(D); U#15 125(RXD) 126(NSLP) 127(NWAKE) 128(TXD); U#16 107(OutPut6) 108(OutPut1) 109(nRes) 110(NCS) 111(GND) 112(GND) 113(NON1) 114(SDO) 115(OutPut8) 116(OutPut3); U?#15 1(QB) 2(QC) 3(QD) 4(QE) 5(QF) 6(QG) 7(QH) 8(GND) 9(SQH) 10(RESET) 11(SHCLK) 12(LATCH) 13(OE) 15(QA) 16(VCC); U?#16 1(QB) 2(QC) 3(QD) 4(QE) 5(QF) 6(QG) 7(QH) 8(GND) 9(SQH) 10(RESET) 11(SHCLK) 12(LATCH) 13(OE) 15(QA) 16(VCC); U?#17 1(QB) 2(QC) 3(QD) 4(QE) 5(QF) 6(QG) 7(QH) 8(GND) 9(SQH) 10(RESET) 11(SHCLK) 12(LATCH) 13(OE) 15(QA) 16(VCC); U?#18 6(QG) 7(QH) 9(SQH) 10(RESET) 11(SHCLK) 12(LATCH) 13(OE); U?#19 1(QB) 2(QC) 3(QD) 4(QE) 5(QF) 6(QG) 7(QH) 8(GND) 9(SQH) 10(RESET) 11(SHCLK) 12(LATCH) 13(OE) 15(QA) 16(VCC); U?#20 1(QB) 2(QC) 3(QD) 4(QE) 5(QF) 6(QG) 7(QH) 8(GND) 9(SQH) 10(RESET) 11(SHCLK) 12(LATCH) 13(OE) 15(QA) 16(VCC); U?#21 1(QB) 2(QC) 3(QD) 4(QE) 5(QF) 6(QG) 7(QH) 8(GND) 9(SQH) 10(RESET) 11(SHCLK) 12(LATCH) 13(OE) 15(QA) 16(VCC); U?#22 1(QB) 2(QC) 3(QD) 4(QE) 5(QF) 6(QG) 7(QH) 8(GND) 9(SQH) 10(RESET) 11(SHCLK) 12(LATCH) 13(OE) 15(QA) 16(VCC); U?#23 83(Input0) 84(~{FaultRst}) 85(SEN) 86(GND) 87(SEL0) 88(SEL1) 89(MultiSense) 90(Input1) 91(OutPut0) 92(OutPut0) 93(OutPut0) 94(OutPut0) 95(OutPut1) 96(OutPut1) 97(OutPut1) 98(OutPut1); U?#24 83(Input0) 84(~{FaultRst}) 85(SEN) 86(GND) 87(SEL0) 88(SEL1) 89(MultiSense) 90(Input1) 91(OutPut0) 92(OutPut0) 93(OutPut0) 94(OutPut0) 95(OutPut1) 96(OutPut1) 97(OutPut1) 98(OutPut1); U?#25 83(Input0) 84(~{FaultRst}) 85(SEN) 86(GND) 87(SEL0) 88(SEL1) 89(MultiSense) 90(Input1) 91(OutPut0) 92(OutPut0) 93(OutPut0) 94(OutPut0) 95(OutPut1) 96(OutPut1) 97(OutPut1) 98(OutPut1); U?#26 83(Input0) 84(~{FaultRst}) 85(SEN) 86(GND) 87(SEL0) 88(SEL1) 89(MultiSense) 90(Input1) 91(OutPut0) 92(OutPut0) 93(OutPut0) 94(OutPut0) 95(OutPut1) 96(OutPut1) 97(OutPut1) 98(OutPut1); U?#27 83(Input0) 84(~{FaultRst}) 85(SEN) 86(GND) 87(SEL0) 88(SEL1) 89(MultiSense) 90(Input1) 91(OutPut0) 92(OutPut0) 93(OutPut0) 94(OutPut0) 95(OutPut1) 96(OutPut1) 97(OutPut1) 98(OutPut1); U?#28 83(Input0) 84(~{FaultRst}) 85(SEN) 86(GND) 87(SEL0) 88(SEL1) 89(MultiSense) 90(Input1) 91(OutPut0) 92(OutPut0) 93(OutPut0) 94(OutPut0) 95(OutPut1) 96(OutPut1) 97(OutPut1) 98(OutPut1); U?#29 83(Input0) 84(~{FaultRst}) 85(SEN) 86(GND) 87(SEL0) 88(SEL1) 89(MultiSense) 90(Input1) 91(OutPut0) 92(OutPut0) 93(OutPut0) 94(OutPut0) 95(OutPut1) 96(OutPut1) 97(OutPut1) 98(OutPut1); U?#30 83(Input0) 84(~{FaultRst}) 85(SEN) 86(GND) 87(SEL0) 88(SEL1) 89(MultiSense) 90(Input1) 91(OutPut0) 92(OutPut0) 93(OutPut0) 94(OutPut0) 95(OutPut1) 96(OutPut1) 97(OutPut1) 98(OutPut1); U?#31 83(Input0) 84(~{FaultRst}) 85(SEN) 86(GND) 87(SEL0) 88(SEL1) 89(MultiSense) 90(Input1) 91(OutPut0) 92(OutPut0) 93(OutPut0) 94(OutPut0) 95(OutPut1) 96(OutPut1) 97(OutPut1) 98(OutPut1); U?#32 83(Input0) 84(~{FaultRst}) 85(SEN) 86(GND) 87(SEL0) 88(SEL1) 89(MultiSense) 90(Input1) 91(OutPut0) 92(OutPut0) 93(OutPut0) 94(OutPut0) 95(OutPut1) 96(OutPut1) 97(OutPut1) 98(OutPut1)

### Notes on the sheet
- (near U?#25) 三态输出控制器
- 三态输出控制器

## Nets that join several sheets
DEBUG: BCM1 (16 pins), BCM2 (58 pins), BCM3 (U#1.8), BCM4 (U#8.8 U?#18.8)
MCU_TDI: BCM1 (U1.86), BCM2 (13 pins)
VCC: BCM2 (R2.1), BCM3 (U#1.7 U#1.16), BCM4 (U#8.16 U?#18.16)
74HC595_A0: BCM1 (U1.68), BCM4 (U#8.14)
74HC595_A1: BCM1 (U1.61), BCM4 (U?#18.14)
74HC595_A2: BCM1 (U1.63), BCM4 (U?#15.14)
74HC595_A3: BCM1 (U1.67), BCM4 (U?#19.14)
74HC595_A4: BCM1 (U1.117), BCM4 (U?#16.14)
74HC595_A5: BCM1 (U1.119), BCM4 (U?#20.14)
74HC595_A6: BCM1 (U1.121), BCM4 (U?#17.14)
74HC595_A7: BCM1 (U1.125), BCM4 (U?#21.14)
74HC595_A8: BCM1 (U1.3), BCM4 (?.14)
74HC595_A9: BCM1 (U1.140), BCM4 (U?#22.14)
ADC0_Group0: BCM1 (U1.43), BCM3 (U?#1.3)
ADC0_Group1: BCM1 (U1.47), BCM3 (U#1.3)
ADC0_Group2: BCM1 (U1.41), BCM3 (U?#2.3)
ADC0_Group3: BCM1 (U1.45), BCM3 (U?#5.3)
ADC0_Group5: BCM1 (U1.49), BCM3 (U?#3.3)
ADC0_Group6: BCM1 (U1.48), BCM3 (U?#6.3)
ADC0_Group7: BCM1 (U1.42), BCM3 (U?#4.3)
ADC0_Group8: BCM1 (U1.44), BCM3 (U?#7.3)
ADC0_SEL0: BCM1 (U1.52), BCM3 (13 pins)
ADC0_SEL1: BCM1 (U1.53), BCM3 (13 pins)
ADC0_SEL2: BCM1 (U1.54), BCM3 (13 pins)
ADC1_Group0: BCM1 (U1.60), BCM3 (U?#8.3)
ADC1_Group1: BCM1 (U1.64), BCM3 (U?#9.3)
ADC1_Group2: BCM1 (U1.62), BCM3 (U?#10.3)
ADC1_Group3: BCM1 (U1.66), BCM3 (U?#11.3)
ADC1_Group4: BCM1 (U1.65), BCM3 (U?#12.3)
CentralDoorLockCtrl: BCM1 (J2.13), BCM4 (U?#18.4)
CentralDoorLockSwitch: BCM1 (J1.15), BCM3 (U?#1.4)
DEBUG_RST: BCM1 (U1.31), BCM2 (P2.9 U4.24)
FCCU_F1: BCM1 (U1.141), BCM2 (J3.2)
FCCU_F2: BCM1 (U1.38), BCM2 (J4.2)
FrontHoodSwitchStatus: BCM1 (J1.13), BCM3 (U?#1.14)
HighSpeed: BCM1 (J2.2), BCM4 (U#8.1)
IntervSpeed: BCM1 (J2.3), BCM4 (U#8.2)
LFDoorFbkStatus: BCM1 (J1.8), BCM3 (U?#1.15)
LFDoorLockCtrl: BCM1 (J2.5), BCM4 (U#8.4)
LFDoorSwitchStatus: BCM1 (J1.4), BCM3 (U#1.1)
LFDoorUnLockCtrl: BCM1 (J2.12), BCM4 (U?#18.3)
LIN_RX: BCM1 (U1.99), BCM2 (U4.23)
LowSpeed: BCM1 (J2.1), BCM4 (U#8.15)
LRDoorFbkStatus: BCM1 (J1.9), BCM3 (U?#1.1)
LRDoorLockCtrl: BCM1 (J2.7), BCM4 (U#8.6)
LRDoorSwitchStatus: BCM1 (J1.6), BCM3 (U#1.2)
LRDoorUnLockCtrl: BCM1 (J2.10), BCM4 (U?#18.1)
MCU_JCOMP: BCM1 (U1.123), BCM2 (P2.14 R30.2)
MCU_TCLK: BCM1 (U1.88), BCM2 (U5.7)
MCU_TMS: BCM1 (U1.87), BCM2 (U6.4)
MUX_OUT: BCM1 (U1.55), BCM2 (C18.2 R8.2)
RFDoorFbkStatus: BCM1 (J1.10), BCM3 (U?#1.12)
RFDoorLockCtrl: BCM1 (J2.8), BCM4 (U#8.7)
RFDoorSwitchStatus: BCM1 (J1.5), BCM3 (U#1.5)
RFDoorUnLockCtrl: BCM1 (J2.11), BCM4 (U?#18.2)
RRDoorFbkStatus: BCM1 (J1.11), BCM3 (U?#1.5)
RRDoorLockCtrl: BCM1 (J2.6), BCM4 (U#8.5)
RRDoorSwitchStatus: BCM1 (J1.7), BCM3 (U#1.4)
RRDoorUnLockCtrl: BCM1 (J2.9), BCM4 (U?#18.15)
TrunkDoorFbkStatus: BCM1 (J1.12), BCM3 (U?#1.2)
TrunkDoorSwitchStatus: BCM1 (J1.14), BCM3 (U?#1.13)
TrunkDoorUnlockCtrl: BCM1 (J2.14), BCM4 (U?#18.5)
Wash_Ctrl: BCM1 (J2.4), BCM4 (U#8.3)
WiperGear_High: BCM1 (J1.2), BCM3 (U#1.15)
WiperGear_Inte: BCM1 (J1.3), BCM3 (U#1.12)
WiperGear_Low: BCM1 (J1.1), BCM3 (U#1.14)